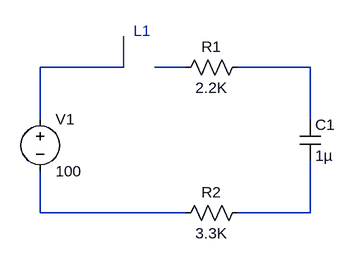
[diagram p0: schematic EJ4_teoría.asc]
EJ4_teoría.asc, the LTspice schematic file:
Version 4.1
SHEET 1 920 680
WIRE 192 -144 192 -192
WIRE 192 -144 64 -144
WIRE 288 -144 240 -144
WIRE 480 -144 368 -144
WIRE 64 -64 64 -144
WIRE 480 -64 480 -144
WIRE 64 80 64 16
WIRE 288 80 64 80
WIRE 480 80 480 0
WIRE 480 80 368 80
SYMBOL voltage 64 -80 R0
SYMATTR InstName V1
SYMATTR Value 100
SYMBOL res 384 -160 R90
WINDOW 0 0 56 VBottom 2
WINDOW 3 32 56 VTop 2
SYMATTR InstName R1
SYMATTR Value 2.2K
SYMBOL res 384 64 R90
WINDOW 0 0 56 VBottom 2
WINDOW 3 32 56 VTop 2
SYMATTR InstName R2
SYMATTR Value 3.3K
SYMBOL cap 464 -64 R0
SYMATTR InstName C1
SYMATTR Value 1µ
TEXT 208 -200 Left 2 ;L1

The netlist it stands for:
* EJ4_teoría.asc
V1 N001 N004 100
R1 N003 N002 2.2K
R2 N005 N004 3.3K
C1 N003 N005 1µ
* L1
.backanno
.end